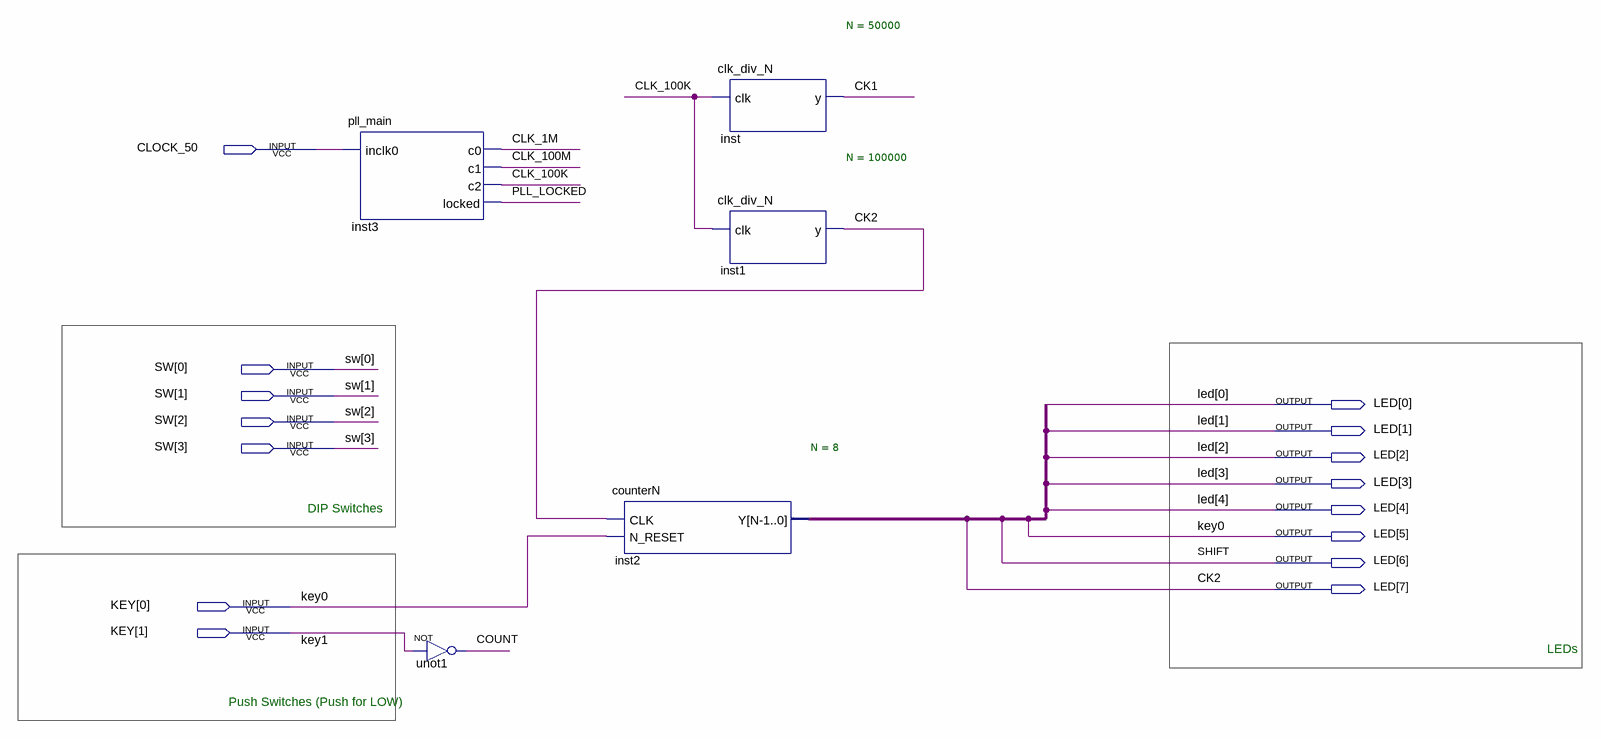
[diagram p0: schematic sheet]
// Quartus schematic TopLevelSchematic.bdf as structural Verilog: 5 symbols, 15 pins
module TopLevelSchematic (
  input  CLOCK_50,
  input  [3:0] SW,
  input  [1:0] KEY,
  output [7:0] LED
);

  wire CK1, CLK_1M, CLK_100K, CLK_100M, COUNT, PLL_LOCKED;
  wire [7:0] inst2_y;

  pll_main inst3 (.inclk0(CLOCK_50), .c0(CLK_1M), .c1(CLK_100M), .c2(CLK_100K), .locked(PLL_LOCKED));
  not unot1 (COUNT, KEY[1]);
  counterN #(.N(8)) inst2 (.CLK(LED[7]), .N_RESET(KEY[0]), .Y(inst2_y));
  clk_div_N #(.N(50000)) inst (.clk(CLK_100K), .y(CK1));
  clk_div_N #(.N(100000)) inst1 (.clk(CLK_100K), .y(LED[7]));

  assign LED[5] = KEY[0];

  // Other names for the same wires on the sheet: CK2 = LED[7]; SHIFT = LED[6]

  // Notes on the sheet:
  //   DIP Switches
  //   LEDs
  //   Push Switches (Push for LOW)
endmodule
